# Altium schematic sheet Inputs.SchDoc
size Letter
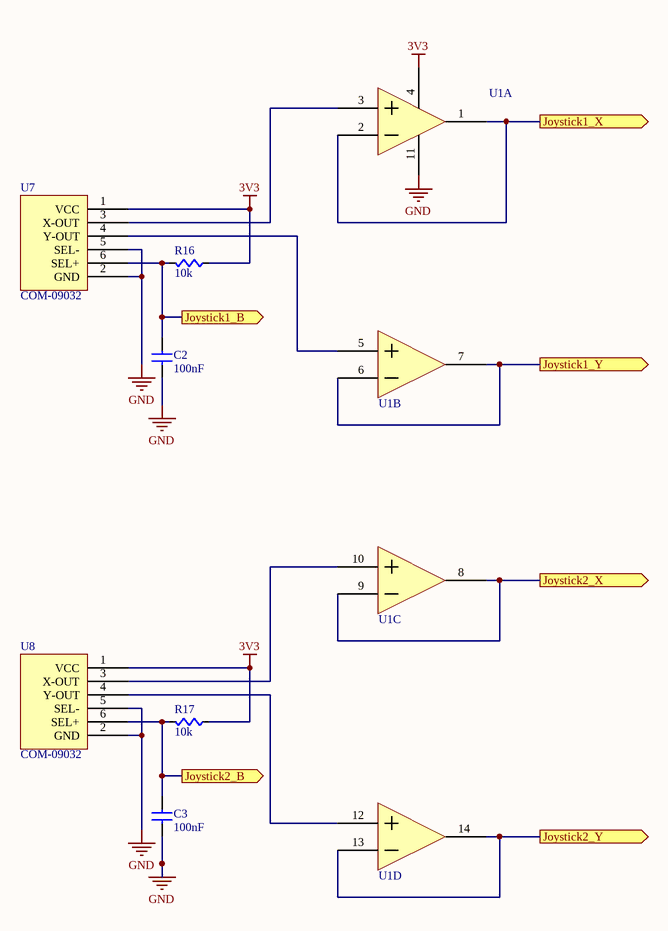
[diagram p0: Inputs.SchDoc]

## Parts
C2  value 100nF  [CAPC0603]  (hidden comment: Cap)
C3  value 100nF  [CAPC0603]  (hidden comment: Cap)
R16  value 10k  [RES0603]  (hidden comment: Res)
R17  value 10k  [RES0603]  (hidden comment: Res)
U1  MCP6L04  [MCP6L04T-E/SL]  (value not drawn)  (parts A,B,C,D of 4)
U7  COM-09032  [Joystick]
U8  COM-09032  [Joystick]

## Ports
Joystick1_B (out), Joystick1_X (out), Joystick1_Y (out), Joystick2_B (out), Joystick2_X (out), Joystick2_Y (out)

## Nets
3V3: R16.2(B) R17.2(B) U1.4(VDD) U7.1(VCC) U8.1(VCC)
GND: C2.2(B) C3.2(B) U1.11(VSS) U7.2(GND) U7.5(SEL-) U8.2(GND) U8.5(SEL-)
Joystick1_B: C2.1(A) R16.1(A) U7.6(SEL+) ; port Joystick1_B
Joystick1_X: U1.1(VOUTA) U1.2(VINA-) ; port Joystick1_X
Joystick1_Y: U1.6(VINB-) U1.7(VOUTB) ; port Joystick1_Y
Joystick2_B: C3.1(A) R17.1(A) U8.6(SEL+) ; port Joystick2_B
Joystick2_X: U1.8(VOUTC) U1.9(VINC-) ; port Joystick2_X
Joystick2_Y: U1.13(VIND-) U1.14(VOUTD) ; port Joystick2_Y
NetU1_3: U1.3(VINA+) U7.3(X-OUT)
NetU1_5: U1.5(VINB+) U7.4(Y-OUT)
NetU1_10: U1.10(VINC+) U8.3(X-OUT)
NetU1_12: U1.12(VIND+) U8.4(Y-OUT)

## Library data of the parts
U1 = MCP6L04: Quad Op Amp Rail-to-Rail 1Mhz; Supplier 1: Digi-Key
U7 U8 = COM-09032: 2 Axis 10 kOhms Through Hole Joystick Potentiometer; Manufacturer 1: SparkFun Electronics; ComponentLink1: Datasheet; Supplier 1: Digi-Key; Supplier Part Number 1: 1568-1526-ND; Manufacturer Part Number 1: COM-09032; ComponentLink1URL: https://media.digikey.com/pdf/Data%20Sheets/Sparkfun%20PDFs/COM-09032_Web.pdf; ComponentLink2: *; ComponentLink2URL: https://www.sparkfun.com/products/9032
C2 C3 = Cap: Supplier 1: Digi-Key; Supplier Part Number 1: 1276-1000-1-ND
R16 R17 = Res: Supplier 1: Digi-Key; Supplier Part Number 1: RMCF0603FT10K0CT-ND